# Altium schematic sheet Electro-mechanical.SchDoc
size A4; SheetNumber: 2; SheetTotal: 6
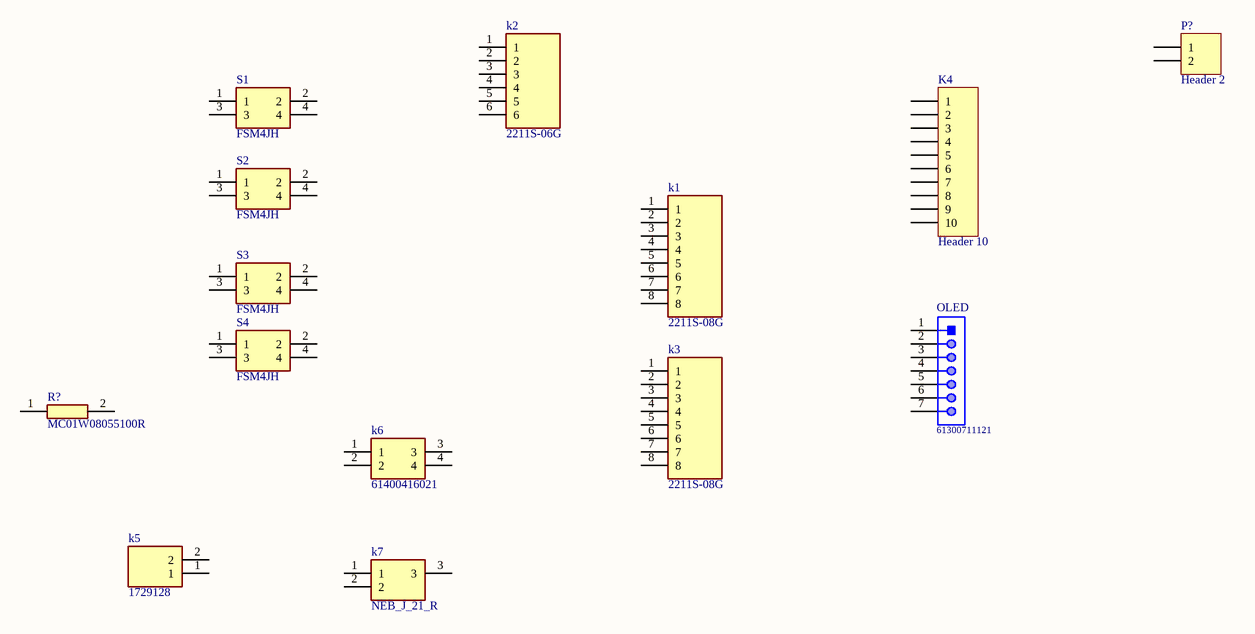
[diagram p0: Electro-mechanical.SchDoc]

## Parts
k1  2211S-08G  [HDRV8W64P0X254_1X8_2032X254X874P]
k2  2211S-06G  [HDRV6W64P0X254_1X6_1524X254X1774P]
k3  2211S-08G  [HDRV8W64P0X254_1X8_2032X254X874P]
K4  Header 10  [HDR1X10]
k5  1729128  [HDRV2W110P0X508_1X2_1016X810X1000P]
k6  61400416021  [USB-2.0-TYPE-A]
k7  NEB_J_21_R  [NEBJ21R]
OLED  61300711121  [61300711121]
P?  Header 2  [HDR1X2]
R?  MC01W08055100R  [RESC2014X65N]
S1  FSM4JH  [FSM4JH]
S2  FSM4JH  [FSM4JH]
S3  FSM4JH  [FSM4JH]
S4  FSM4JH  [FSM4JH]

## Nets

Not connected (* = marked no-connect by the designer): k1 1 2 3 4 5 6 7 8; k2 1 2 3 4 5 6; k3 1 2 3 4 5 6 7 8; K4 1 2 3 4 5 6 7 8 9 10; k5 1 2; k6 1 2 3 4; k7 1 2 3; OLED 1 2 3 4 5 6 7; P? 1 2; R? 1 2; S1 1 2 3 4; S2 1 2 3 4; S3 1 2 3 4; S4 1 2 3 4

## Library data of the parts
k1 k3 = 2211S-08G: Connector; Manufacturer_Name: MULTICOMP; Datasheet Link: https://componentsearchengine.com/Datasheets/2/2211S-08G.pdf; Height: 8.74mm; Manufacturer_Part_Number: 2211S-08G
k2 = 2211S-06G: Connector; Manufacturer_Name: MULTICOMP; Datasheet Link: http://www.farnell.com/datasheets/1518407.pdf; Height: 17.74mm; Manufacturer_Part_Number: 2211S-06G
K4 = Header 10: Header, 10-Pin; LatestRevisionDate: 17-Jul-2002; LatestRevisionNote: Re-released for DXP Platform.; Publisher: Altium Limited
k5 = 1729128: Connector; Manufacturer_Name: Phoenix Contact; Datasheet Link: http://docs-emea.rs-online.com/webdocs/1380/0900766b81380189.pdf; Height: 10mm; Manufacturer_Part_Number: 1729128; Mouser Part Number: 651-1729128; Mouser Price/Stock: https://www.mouser.co.uk/ProductDetail/Phoenix-Contact/1729128/?qs=GFUSqQMLmmnCBVBY3dts9w%3D%3D; Arrow Part Number: 1729128; Arrow Price/Stock: https://www.arrow.com/en/products/1729128/phoenix-contact
k6 = 61400416021: Connector; Manufacturer_Name: Wurth Elektronik; Datasheet Link: http://katalog.we-online.de/em/datasheet/61400416021.pdf; Manufacturer_Part_Number: 61400416021; Mouser Part Number: 710-61400416021; Mouser Price/Stock: https://www.mouser.co.uk/ProductDetail/Wurth-Elektronik/61400416021/?qs=rS3zZhy2AQM1ZldAqz%2FFOw%3D%3D
k7 = NEB_J_21_R: Connector; Manufacturer_Name: LUMBERG; Manufacturer_Part_Number: NEB/J 21 R; Datasheet Link: http://www.farnell.com/datasheets/2047481.pdf?_ga=2.269136052.479969064.1560760329-167411096.1502103357; Height: 8mm
OLED = CMP-1502-01074-1: THT Vertical Pin Header WR-PHD, Pitch 2.54 mm, Single Row, 7 pins; Manufacturer: Wurth Elektronik; Pin Number: 7; Gender: Male; Working Voltage: 250VAC; Contact Resistance: 20mOhm; Rated Current: 3A; Pitch: 2.54mm; Withstanding Voltage: 500VAC; Row Number: Single; Packaging: Bag; Orientation: Vertical; Manufacturer URL: http://www.we-online.de; Datasheet URL: https://katalog.we-online.de/em/datasheet/6130xx11121.pdf; Part Number: 61300711121; Publisher: WurthElektronik; Operating Temperature: -40to105degC; Mounting Technology: THT; Package Reference: 61300711121
P? = Header 2: Header, 2-Pin; LatestRevisionDate: 17-Jul-2002; LatestRevisionNote: Re-released for DXP Platform.; Publisher: Altium Limited
R? = MC01W08055100R: Resistor; Manufacturer_Name: MULTICOMP; Datasheet Link: http://www.farnell.com/datasheets/1729047.pdf; Height: 0.65mm; Manufacturer_Part_Number: MC01W08055100R
S1-S4 = FSM4JH: Switch; Manufacturer_Name: TE Connectivity; Datasheet Link: http://www.te.com/commerce/DocumentDelivery/DDEController?Action=showdoc&DocId=Customer+Drawing%7F1825910%7FC9%7Fpdf%7FEnglish%7FENG_CD_1825910_C9.pdf%7F1825910-6; Manufacturer_Part_Number: FSM4JH; Mouser Part Number: 506-FSM4JH; Mouser Price/Stock: https://www.mouser.co.uk/ProductDetail/TE-Connectivity-Alcoswitch/FSM4JH/?qs=g%252BEszo6zu8OwVWrHD2r3Rw%3D%3D; Arrow Part Number: FSM4JH; Arrow Price/Stock: https://www.arrow.com/en/products/fsm4jh/te-connectivity